# Altium schematic sheet Vstupy.SchDoc: Vstupy
size A3; Page Size: A3; Page Count: 1; Page Number: 1
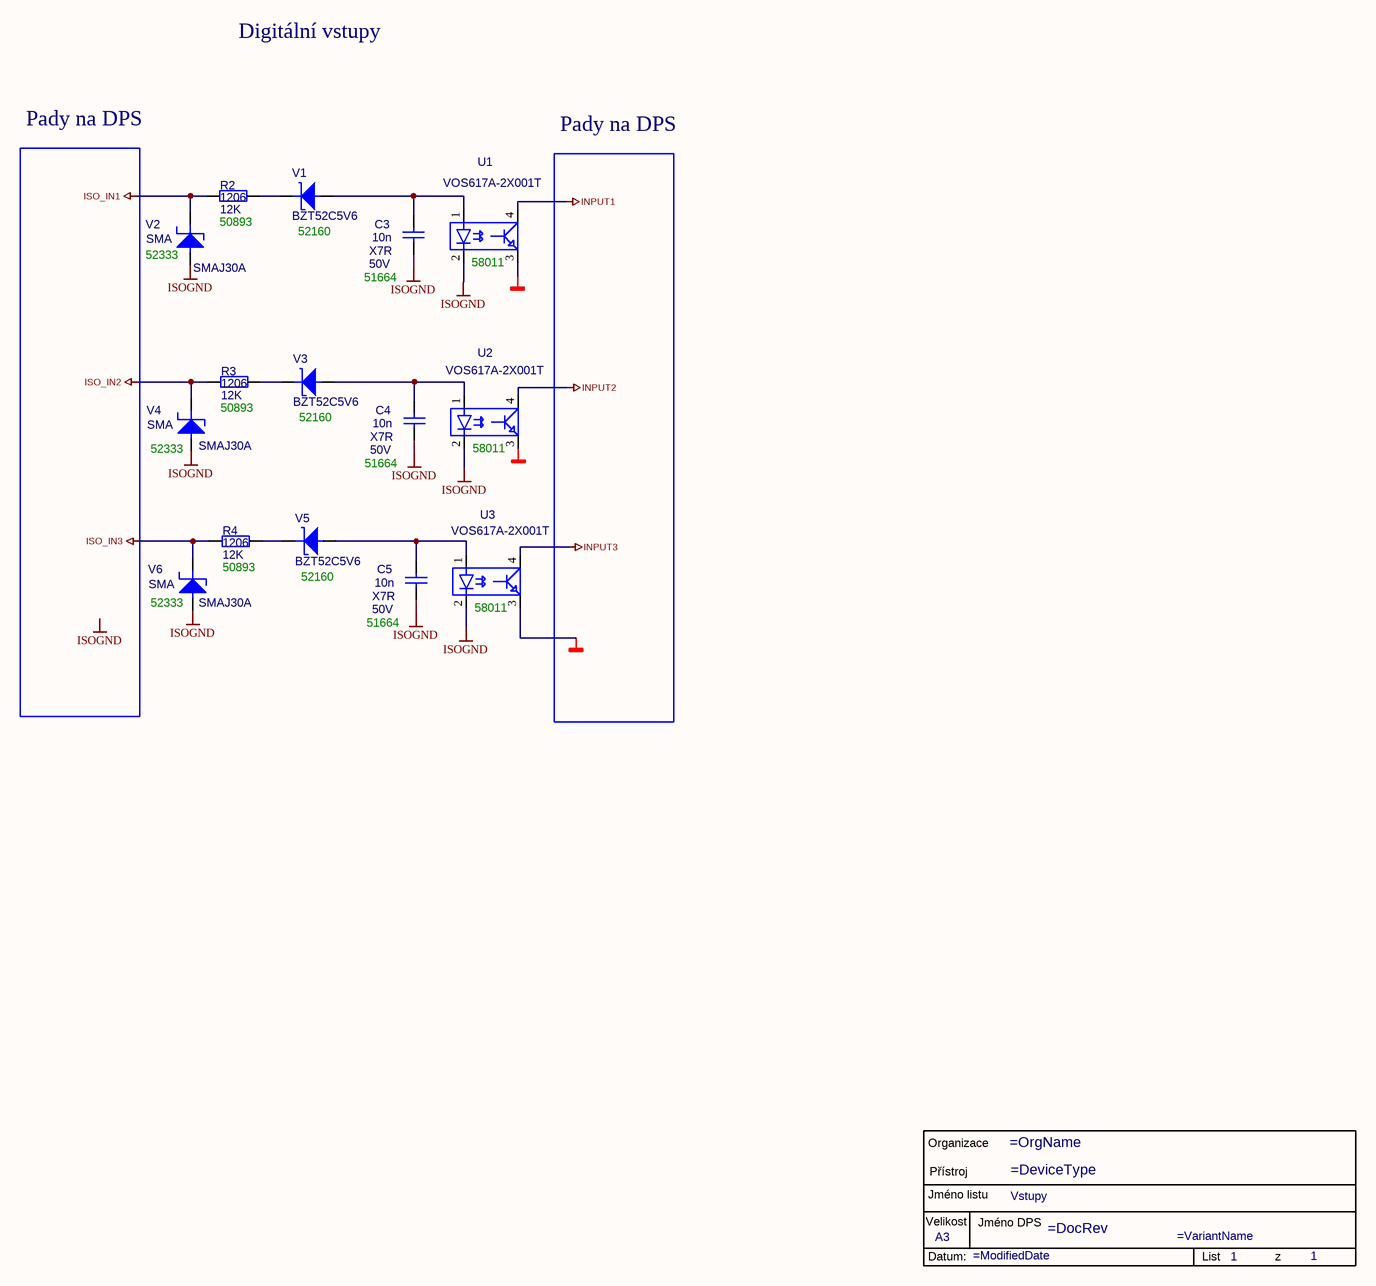
[diagram p0: Vstupy.SchDoc]

## Parts
*  RAZITKO  (value not drawn)  (graphical)
C3  10n  Voltage: 50V  Tolerance: X7R  MEgA_ID: 51664  [Z0603]
C4  10n  Voltage: 50V  Tolerance: X7R  MEgA_ID: 51664  [Z0603]
C5  10n  Voltage: 50V  Tolerance: X7R  MEgA_ID: 51664  [Z0603]
R2  12K  MEgA_ID: 50893  Size: 1206  [Z1206]
R3  12K  MEgA_ID: 50893  Size: 1206  [Z1206]
R4  12K  MEgA_ID: 50893  Size: 1206  [Z1206]
U1  VOS617A-2X001T  MEgA_ID: 58011  [ZSSOP-4]
U2  VOS617A-2X001T  MEgA_ID: 58011  [ZSSOP-4]
U3  VOS617A-2X001T  MEgA_ID: 58011  [ZSSOP-4]
V1  BZT52C5V6  MEgA_ID: 52160  [ZSOD123]
V2  SMAJ30A  Size: SMA  MEGA_ID: 52333  [ZSMA]
V3  BZT52C5V6  MEgA_ID: 52160  [ZSOD123]
V4  SMAJ30A  Size: SMA  MEGA_ID: 52333  [ZSMA]
V5  BZT52C5V6  MEgA_ID: 52160  [ZSOD123]
V6  SMAJ30A  Size: SMA  MEGA_ID: 52333  [ZSMA]

## Nets
GND: U1.3 U2.3 U3.3
INPUT1: U1.4
INPUT2: U2.4
INPUT3: U3.4
ISO_IN1: R2.1 V2.2(K)
ISO_IN2: R3.1 V4.2(K)
ISO_IN3: R4.1 V6.2(K)
ISOGND: C3.2 C4.2 C5.2 U1.2 U2.2 U3.2 V2.1(A) V4.1(A) V6.1(A)
NetC3_1: C3.1 U1.1 V1.1(A)
NetC4_1: C4.1 U2.1 V3.1(A)
NetC5_1: C5.1 U3.1 V5.1(A)
NetR2_2: R2.2 V1.2(K)
NetR3_2: R3.2 V3.2(K)
NetR4_2: R4.2 V5.2(K)

## Notes on the sheet
- Digitální vstupy
- Pady na DPS
- Labels drawn without touching a wire or pin: ISOGND
- (in symbol RAZITKO) Organizace; Přístroj; Jméno listu; Velikost; Jméno DPS; Datum:; List; z

## Library data of the parts
C3-C5 = C: Assembled: Automat; Size: 0603; Value: 10n; PCB Footprint: Z0603
R2-R4 = R: Assembled: Automat; Tolerance: 1%; Value: 12K; PCB Footprint: Z1206
U1-U3 = OPTO1_1: Voltage: Uce=80V, Uizol =3.75 kV; Power: If=50mA, Ic=50mA; Assembled: Automat; Value: VOS617A-2X001T; PCB Footprint: ZSSOP-4; Size: SSOP4; Manufacturer: VOS617A-2X001T
V1 V3 V5 = DIODE ZENER: Voltage: 5V6; Power: 0.3W; Assembled: Automat; Value: BZT52C5V6; Size: SOD123; PCB Footprint: ZSOD123
V2 V4 V6 = DIODE TRANSIL: Manufacturer: P4SMAJ30A; Assembled: Automat; Voltage: 30V; Power: 400W Uni; Value: SMAJ30A; PCB Footprint: ZSMA